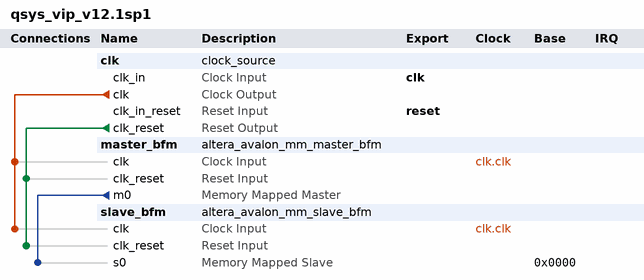
[diagram p0: system contents]
# Platform Designer (Qsys) system qsys_vip_v12.1sp1, Cyclone IV E EP4CE22F17C7
# Parameters at their usual value, and those the tool derives, are not listed.
package require -exact qsys 12.1
create_system qsys_vip_v12.1sp1
set_project_property DEVICE_FAMILY {Cyclone IV E}
set_project_property DEVICE EP4CE22F17C7

add_instance clk clock_source 12.1
set_instance_parameter_value clk clockFrequency 50000000

add_instance master_bfm altera_avalon_mm_master_bfm 12.1
set_instance_parameter_value master_bfm AV_ADDRESS_W 32
set_instance_parameter_value master_bfm AV_NUMSYMBOLS 4
set_instance_parameter_value master_bfm AV_BURSTCOUNT_W 8
set_instance_parameter_value master_bfm AV_READRESPONSE_W 8
set_instance_parameter_value master_bfm AV_WRITERESPONSE_W 8
set_instance_parameter_value master_bfm USE_READ 1
set_instance_parameter_value master_bfm USE_BYTE_ENABLE 1
set_instance_parameter_value master_bfm USE_BURSTCOUNT 1
set_instance_parameter_value master_bfm USE_READ_DATA 1
set_instance_parameter_value master_bfm USE_READ_DATA_VALID 1
set_instance_parameter_value master_bfm USE_WAIT_REQUEST 1
set_instance_parameter_value master_bfm AV_CONSTANT_BURST_BEHAVIOR 1
set_instance_parameter_value master_bfm AV_BURST_LINEWRAP 1
set_instance_parameter_value master_bfm AV_BURST_BNDR_ONLY 1
set_instance_parameter_value master_bfm AV_FIX_READ_LATENCY 1
set_instance_parameter_value master_bfm AV_READ_WAIT_TIME 1
set_instance_parameter_value master_bfm ADDRESS_UNITS SYMBOLS

add_instance slave_bfm altera_avalon_mm_slave_bfm 12.1
set_instance_parameter_value slave_bfm AV_ADDRESS_W 20
set_instance_parameter_value slave_bfm AV_SYMBOL_W 8
set_instance_parameter_value slave_bfm AV_NUMSYMBOLS 4
set_instance_parameter_value slave_bfm AV_BURSTCOUNT_W 8
set_instance_parameter_value slave_bfm AV_READRESPONSE_W 8
set_instance_parameter_value slave_bfm AV_WRITERESPONSE_W 8
set_instance_parameter_value slave_bfm USE_READ 1
set_instance_parameter_value slave_bfm USE_WRITE 1
set_instance_parameter_value slave_bfm USE_ADDRESS 1
set_instance_parameter_value slave_bfm USE_BYTE_ENABLE 1
set_instance_parameter_value slave_bfm USE_BURSTCOUNT 1
set_instance_parameter_value slave_bfm USE_READ_DATA 1
set_instance_parameter_value slave_bfm USE_READ_DATA_VALID 1
set_instance_parameter_value slave_bfm USE_WRITE_DATA 1
set_instance_parameter_value slave_bfm USE_BEGIN_TRANSFER 0
set_instance_parameter_value slave_bfm USE_BEGIN_BURST_TRANSFER 0
set_instance_parameter_value slave_bfm USE_ARBITERLOCK 0
set_instance_parameter_value slave_bfm USE_LOCK 0
set_instance_parameter_value slave_bfm USE_DEBUGACCESS 0
set_instance_parameter_value slave_bfm USE_WAIT_REQUEST 1
set_instance_parameter_value slave_bfm USE_TRANSACTIONID 0
set_instance_parameter_value slave_bfm USE_WRITERESPONSE 0
set_instance_parameter_value slave_bfm USE_READRESPONSE 0
set_instance_parameter_value slave_bfm USE_CLKEN 0
set_instance_parameter_value slave_bfm ASSERT_HIGH_RESET 1
set_instance_parameter_value slave_bfm ASSERT_HIGH_WAITREQUEST 1
set_instance_parameter_value slave_bfm ASSERT_HIGH_READ 1
set_instance_parameter_value slave_bfm ASSERT_HIGH_WRITE 1
set_instance_parameter_value slave_bfm ASSERT_HIGH_BYTEENABLE 1
set_instance_parameter_value slave_bfm ASSERT_HIGH_READDATAVALID 1
set_instance_parameter_value slave_bfm ASSERT_HIGH_ARBITERLOCK 1
set_instance_parameter_value slave_bfm ASSERT_HIGH_LOCK 1
set_instance_parameter_value slave_bfm AV_BURST_LINEWRAP 1
set_instance_parameter_value slave_bfm AV_BURST_BNDR_ONLY 1
set_instance_parameter_value slave_bfm AV_MAX_PENDING_READS 8
set_instance_parameter_value slave_bfm AV_FIX_READ_LATENCY 0
set_instance_parameter_value slave_bfm AV_READ_WAIT_TIME 1
set_instance_parameter_value slave_bfm AV_WRITE_WAIT_TIME 0
set_instance_parameter_value slave_bfm REGISTER_WAITREQUEST 0
set_instance_parameter_value slave_bfm AV_REGISTERINCOMINGSIGNALS 0
set_instance_parameter_value slave_bfm ADDRESS_UNITS WORDS

# connections
add_connection clk.clk master_bfm.clk clock
add_connection clk.clk slave_bfm.clk clock
add_connection clk.clk_reset master_bfm.clk_reset reset
add_connection clk.clk_reset slave_bfm.clk_reset reset
add_connection master_bfm.m0 slave_bfm.s0 avalon
set_connection_parameter_value master_bfm.m0/slave_bfm.s0 baseAddress 0x0000

# exported interfaces
add_interface clk clock sink
set_interface_property clk EXPORT_OF clk.clk_in
add_interface reset reset sink
set_interface_property reset EXPORT_OF clk.clk_in_reset

save_system qsys_vip_v12.1sp1.qsys
